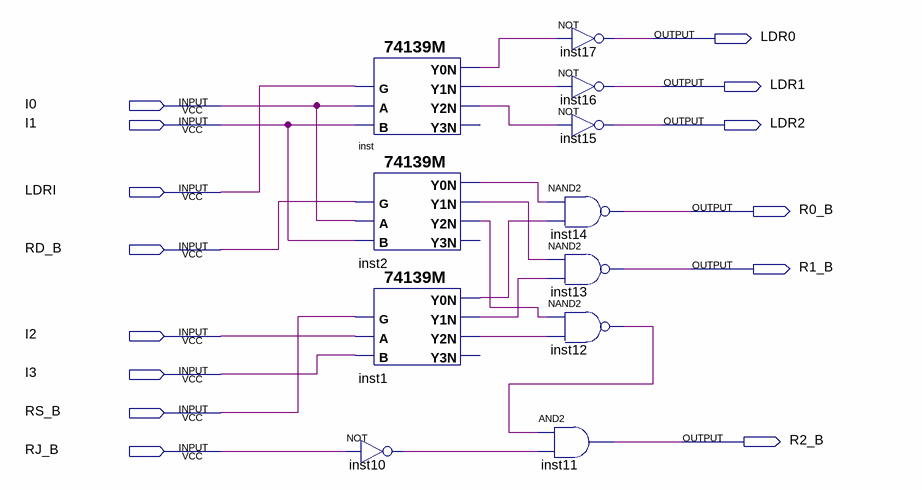
[diagram p0: schematic sheet]
// Quartus schematic data.bdf as structural Verilog: 11 symbols, 14 pins
module data (
  input  I0,
  input  I1,
  input  LDRI,
  input  RD_B,
  input  I2,
  input  I3,
  input  RS_B,
  input  RJ_B,
  output LDR0,
  output LDR1,
  output LDR2,
  output R0_B,
  output R1_B,
  output R2_B
);

  wire inst1_y0n, inst1_y1n, inst1_y2n, inst2_y0n, inst2_y1n, inst2_y2n, inst10_out, inst12_out, inst_y0n,
       inst_y1n, inst_y2n;

  \74139M  inst (.B(I1), .A(I0), .G(LDRI), .Y2N(inst_y2n), .Y0N(inst_y0n), .Y1N(inst_y1n));  // open: Y3N
  \74139M  inst2 (.B(I1), .A(I0), .G(RD_B), .Y2N(inst2_y2n), .Y0N(inst2_y0n), .Y1N(inst2_y1n));  // open: Y3N
  \74139M  inst1 (.B(I3), .A(I2), .G(RS_B), .Y2N(inst1_y2n), .Y0N(inst1_y0n), .Y1N(inst1_y1n));  // open: Y3N
  not inst10 (inst10_out, RJ_B);
  not inst17 (LDR0, inst_y0n);
  not inst16 (LDR1, inst_y1n);
  not inst15 (LDR2, inst_y2n);
  nand inst14 (R0_B, inst2_y0n, inst1_y0n);
  nand inst13 (R1_B, inst2_y1n, inst1_y1n);
  nand inst12 (inst12_out, inst2_y2n, inst1_y2n);
  and inst11 (R2_B, inst12_out, inst10_out);
endmodule
